# EAGLE design PLA_Controller_ring_Gen2_Rev2 (EAGLE 7.7.0)
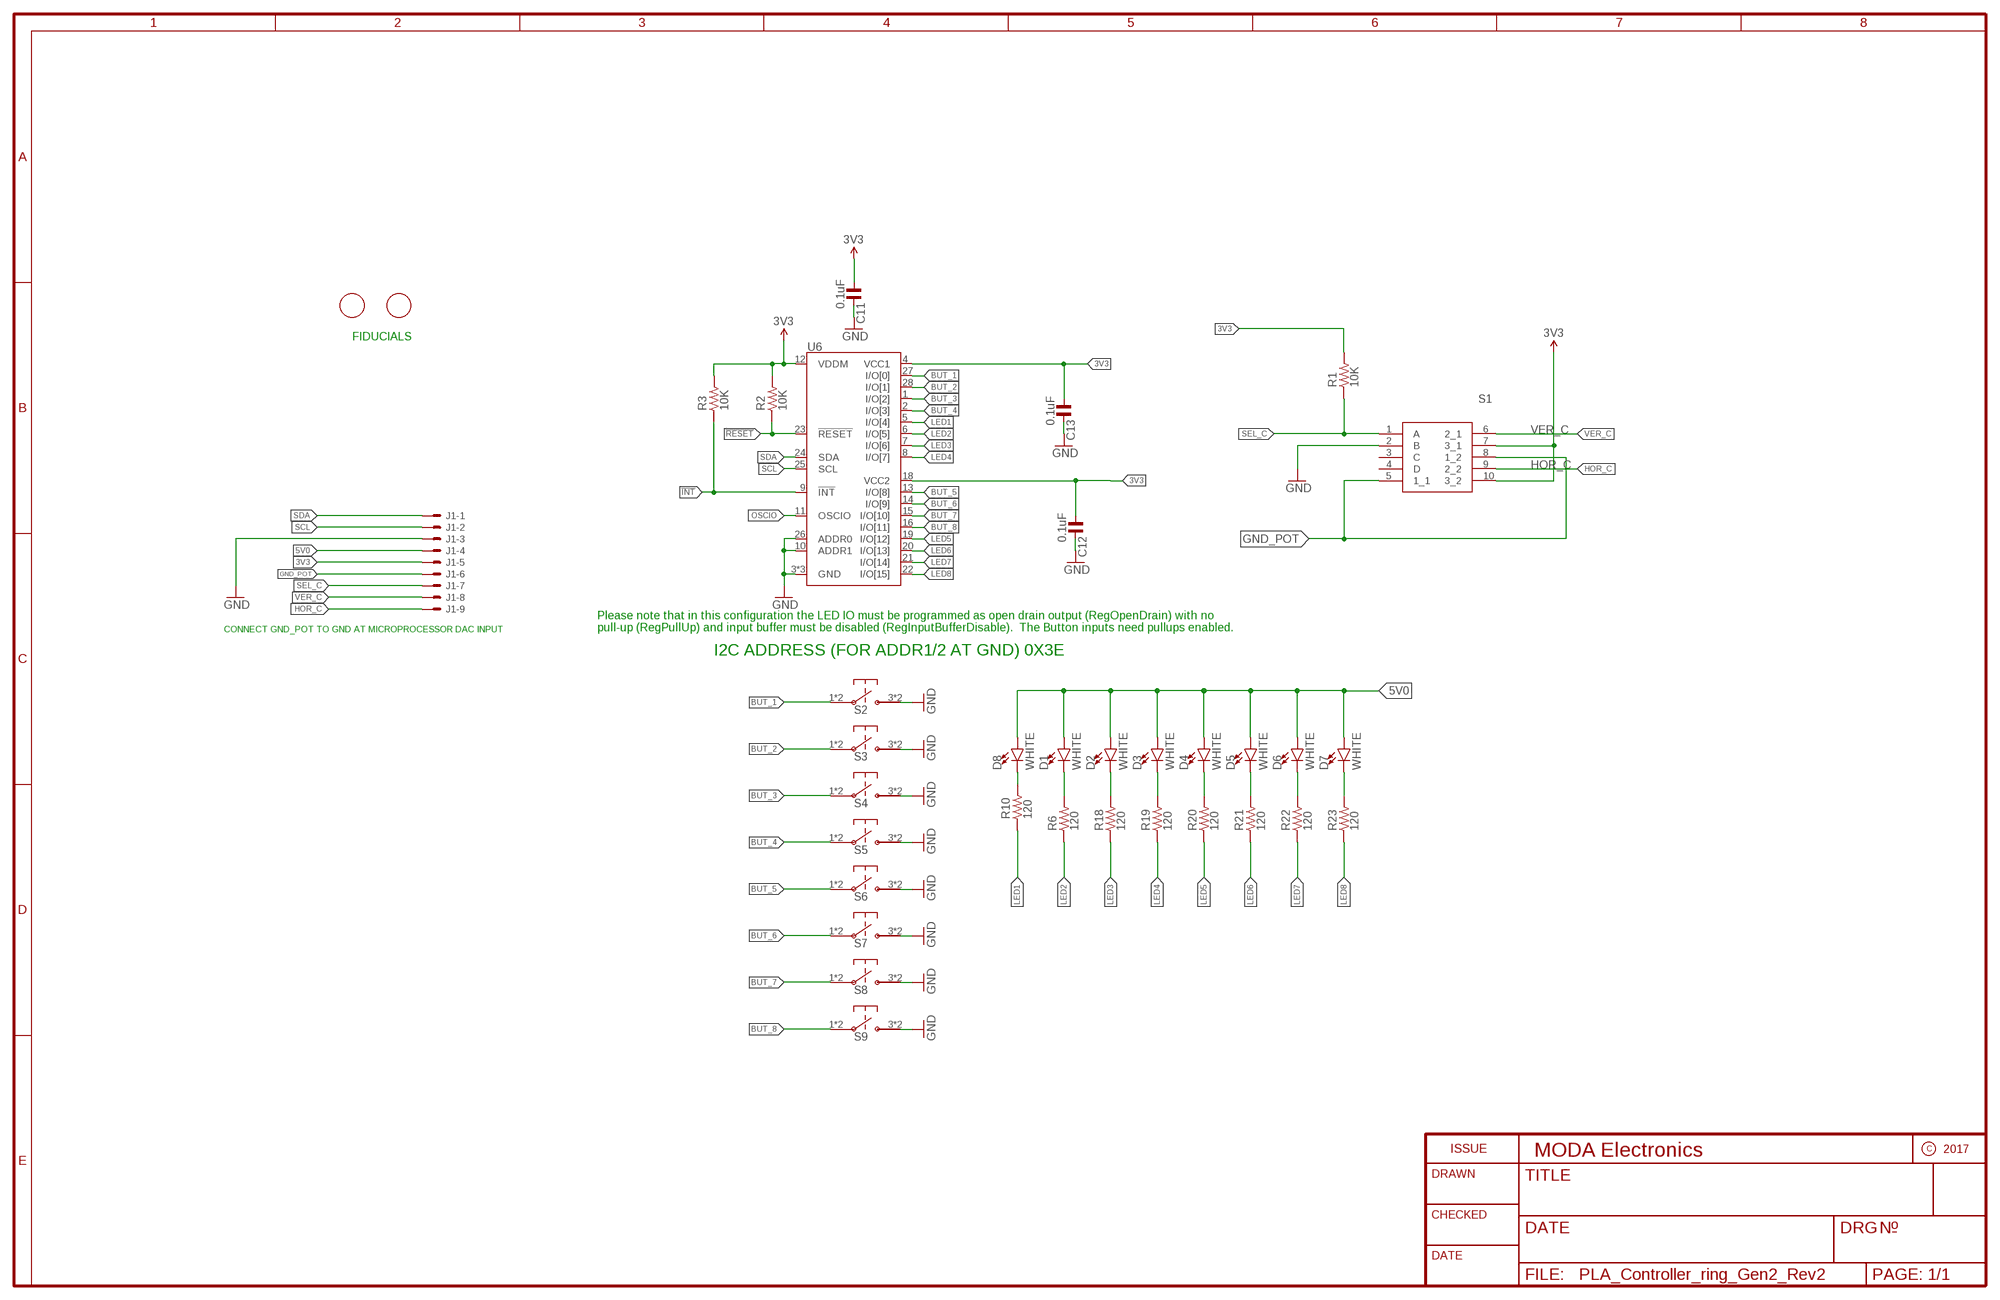
[diagram p0: schematic, sheet 1]

## Parts
C11  0.1uF  C_0603  [C0603]
C12  0.1uF  C_0603  [C0603]
C13  0.1uF  C_0603  [C0603]
D1  WHITE  LED-WHITE0603  [LED-0603]
D2  WHITE  LED-WHITE0603  [LED-0603]
D3  WHITE  LED-WHITE0603  [LED-0603]
D4  WHITE  LED-WHITE0603  [LED-0603]
D5  WHITE  LED-WHITE0603  [LED-0603]
D6  WHITE  LED-WHITE0603  [LED-0603]
D7  WHITE  LED-WHITE0603  [LED-0603]
D8  WHITE  LED-WHITE0603  [LED-0603]
J1  BM09B-SRSS-TB  [BM09B-SRSS-TB]
R1  10K  R_0603  [R0603]
R2  10K  R_0603  [R0603]
R3  10K  R_0603  [R0603]
R6  120  R_0603  [R0603]
R10  120  R_0603  [R0603]
R18  120  R_0603  [R0603]
R19  120  R_0603  [R0603]
R20  120  R_0603  [R0603]
R21  120  R_0603  [R0603]
R22  120  R_0603  [R0603]
R23  120  R_0603  [R0603]
S1  RKJXV1224005  [RKJXV1224005]
S2  TL3315NF100Q  [TL3315NF100Q]
S3  TL3315NF100Q  [TL3315NF100Q]
S4  TL3315NF100Q  [TL3315NF100Q]
S5  TL3315NF100Q  [TL3315NF100Q]
S6  TL3315NF100Q  [TL3315NF100Q]
S7  TL3315NF100Q  [TL3315NF100Q]
S8  TL3315NF100Q  [TL3315NF100Q]
S9  TL3315NF100Q  [TL3315NF100Q]
U6  SX1509  [QFN-28]
U$8  FIDUCIAL  [FIDUCIAL_1MM]
U$9  FIDUCIAL  [FIDUCIAL_1MM]

## Nets
3V3: C11.1 C12.1 C13.1 J1.5 R1.2 R2.2 R3.2 S1.7(3_1) S1.10(3_2) U6.4(VCC1) U6.12(VDDM) U6.18(VCC2)
5V0: D1.A D2.A D3.A D4.A D5.A D6.A D7.A D8.A J1.4
!INT: R3.1 U6.9(!INT)
!RESET: R2.1 U6.23(!RESET)
BUT_1: S2.1 S2.2 U6.27(I/O[0])
BUT_2: S3.1 S3.2 U6.28(I/O[1])
BUT_3: S4.1 S4.2 U6.1(I/O[2])
BUT_4: S5.1 S5.2 U6.2(I/O[3])
BUT_5: S6.1 S6.2 U6.13(I/O[8])
BUT_6: S7.1 S7.2 U6.14(I/O[9])
BUT_7: S8.1 S8.2 U6.15(I/O[10])
BUT_8: S9.1 S9.2 U6.16(I/O[11])
GND [vcc]: C11.2 C12.2 C13.2 J1.3 S1.2(B) S2.3 S2.4 S3.3 S3.4 S4.3 S4.4 S5.3 S5.4 S6.3 S6.4 S7.3 S7.4 S8.3 S8.4 S9.3 S9.4 U6.3(GND) U6.10(ADDR1) U6.17(GND) U6.26(ADDR0) U6.29(GND)
GND_POT [vcc]: J1.6 S1.5(1_1) S1.8(1_2)
HOR_C: J1.9 S1.9(2_2)
LED1: R10.1 U6.5(I/O[4])
LED2: R6.1 U6.6(I/O[5])
LED3: R18.1 U6.7(I/O[6])
LED4: R19.1 U6.8(I/O[7])
LED5: R20.1 U6.19(I/O[12])
LED6: R21.1 U6.20(I/O[13])
LED7: R22.1 U6.21(I/O[14])
LED8: R23.1 U6.22(I/O[15])
N$7: D1.C R6.2
N$10: D8.C R10.2
N$15: D2.C R18.2
N$16: D3.C R19.2
N$17: D4.C R20.2
N$18: D5.C R21.2
N$19: D6.C R22.2
N$20: D7.C R23.2
OSCIO: U6.11(OSCIO)
SCL: J1.2 U6.25(SCL)
SDA: J1.1 U6.24(SDA)
SEL_C: J1.7 R1.1 S1.1(A)
VER_C: J1.8 S1.6(2_1)
Unconnected: S1.3(C) S1.4(D)

## Notes on the sheet
- FIDUCIALS
- CONNECT GND_POT TO GND AT MICROPROCESSOR DAC INPUT
- Please note that in this configuration the LED IO must be programmed as open drain output (RegOpenDrain) with no
  pull-up (RegPullUp) and input buffer must be disabled (RegInputBufferDisable).  The Button inputs need pullups enabled.
- I2C ADDRESS (FOR ADDR1/2 AT GND) 0X3E

## Library data of the parts
C11-C13 = rc-master-smd:C_: NON-POLARIZED CAP; PARTNO: CAP-00810
D1-D8 = SparkFun-LED:LED-WHITE: White SMD LED Used in manufacturing several products at SparkFun. Packages: 0603 - Bright White SMD 0603 package[Product Link] <http://www.kingbrightusa.com/product.asp?catalog_name=LED&product_id=APT1608QWF/D> 1206 - Bright White SMD1206 package [Product Link] <http://www.kingbrightusa.com/product.asp?catalog_name=LED&product_id=APT3216QWF/D> SparkFun Products: Blackberry Trackballer Breakout <https://www.sparkfun.com/products/13169> Digital SandBox <https://www.sparkfun.com/products/12651>; PARTNO: QBLP601-IW
J1 = con-jst:?M09B-SRSS-TB: Disconnectable Crimp style connector, 1.0mm pitch 9 contacts; PARTNO: BM09B-SRSS-TB
R1-R3 = rc-master-smd:R_: RESISTOR; PARTNO: ERJ-2GEJ103X
R6 R10 R18-R23 = rc-master-smd:R_: RESISTOR; PARTNO: ERJ-PA3J121V
S1 = RKJXV1224005:RKJXV1224005: Multi-Directional Switches Stick Controller Source: Datasheet <http://www.alps.com/prod/info/E/HTML/MultiControl/Potentiometer/RKJXK/RKJXV1224005.html>; DESCRIPTION: Multi-Directional Switches Stick Controller; HEIGHT: mm; MANUFACTURER_NAME: ALPS; MANUFACTURER_PART_NUMBER: RKJXV1224005; MOUSER_PART_NUMBER: 688-RKJXV1224005; MOUSER_PRICE-STOCK: https://www.mouser.com/Search/Refine.aspx?Keyword=688-RKJXV1224005; PARTNO: RKJXV1224005; RS_PART_NUMBER: 1239578; RS_PRICE-STOCK: http://uk.rs-online.com/web/p/products/1239578
S2-S9 = TL3315NF100Q:TL3315NF100Q: SWITCH TACTILE SPST-NO 0.05A 15V; AVAILABILITY: Good; DESCRIPTION: TL3315 Series SPST 1 N Round Button J-Bend SMT Low Profile Tactile Switch; MF: E-Switch; MP: TL3315NF100Q; PACKAGE: None; PARTNO: TL3315NF100Q; PRICE: 0.13 USD
U6 = SparkFun-DigitalIC:SX1509: Semtech SX1509 The SX1509 is a complete ultra low voltage 1.2V to 3.6V General Purpose parallel Input/Output (GPIO) expanders ideal for low power handheld battery powered equipment. This version comes in a 16-channel configuration and allows easy serial expansion of I/O through a standard 400kHz I2C interface. GPIO devices can provide additional control and monitoring when the microcontroller or chipset has insufficient I/O ports, or in systems where serial communication and control from a remote location is advantageous.; PARTNO: SX1509BIULTRT; PROD_ID: IC-11311; VALUE: SX1509
U$8 U$9 = adafruit:FIDUCIAL: For use by pick and place machines to calibrate the vision/machine, 1mm By microbuilder.eu; DNP: T; PARTNO: *

## Net classes
0 default: width 0.203 mm
3 diff90: width 0.104 mm, drill 0.203 mm, clearance 0.127 mm

## Board
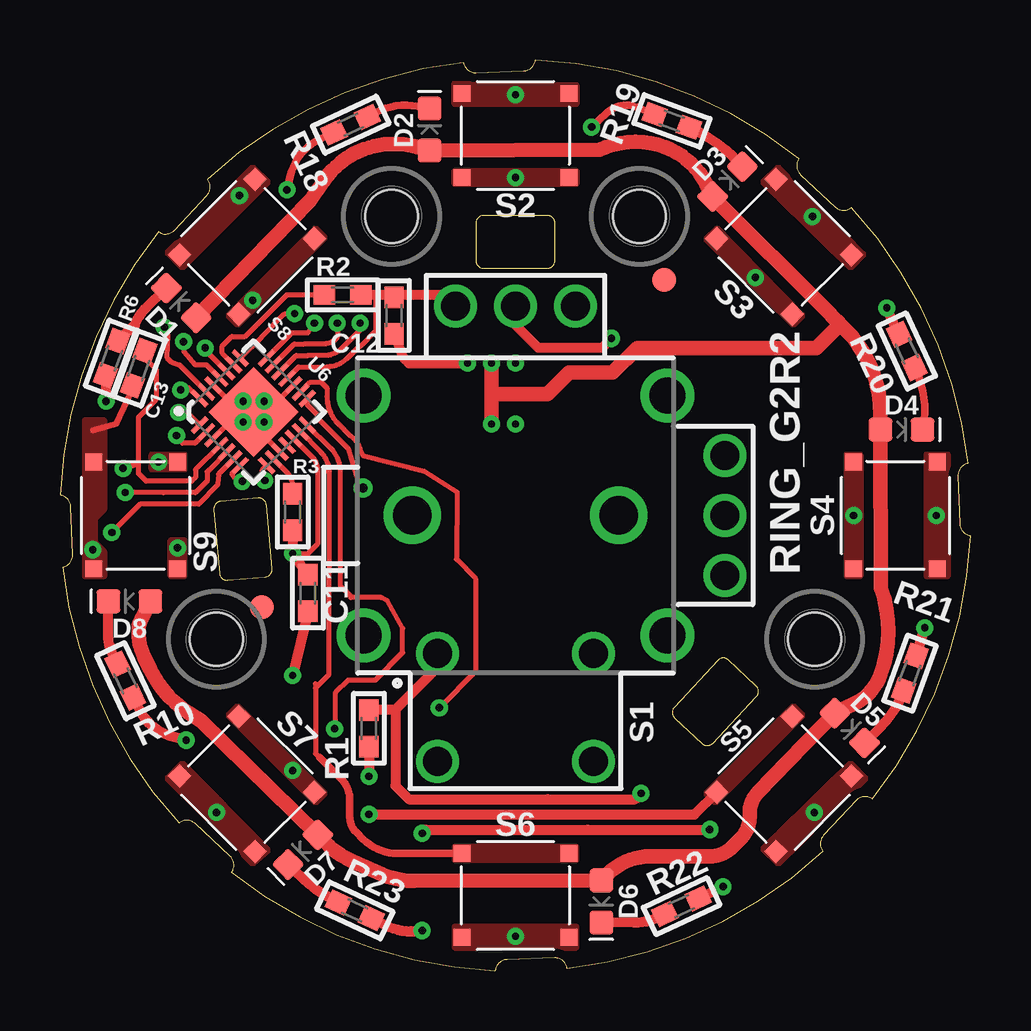
[diagram p1: board, top side]
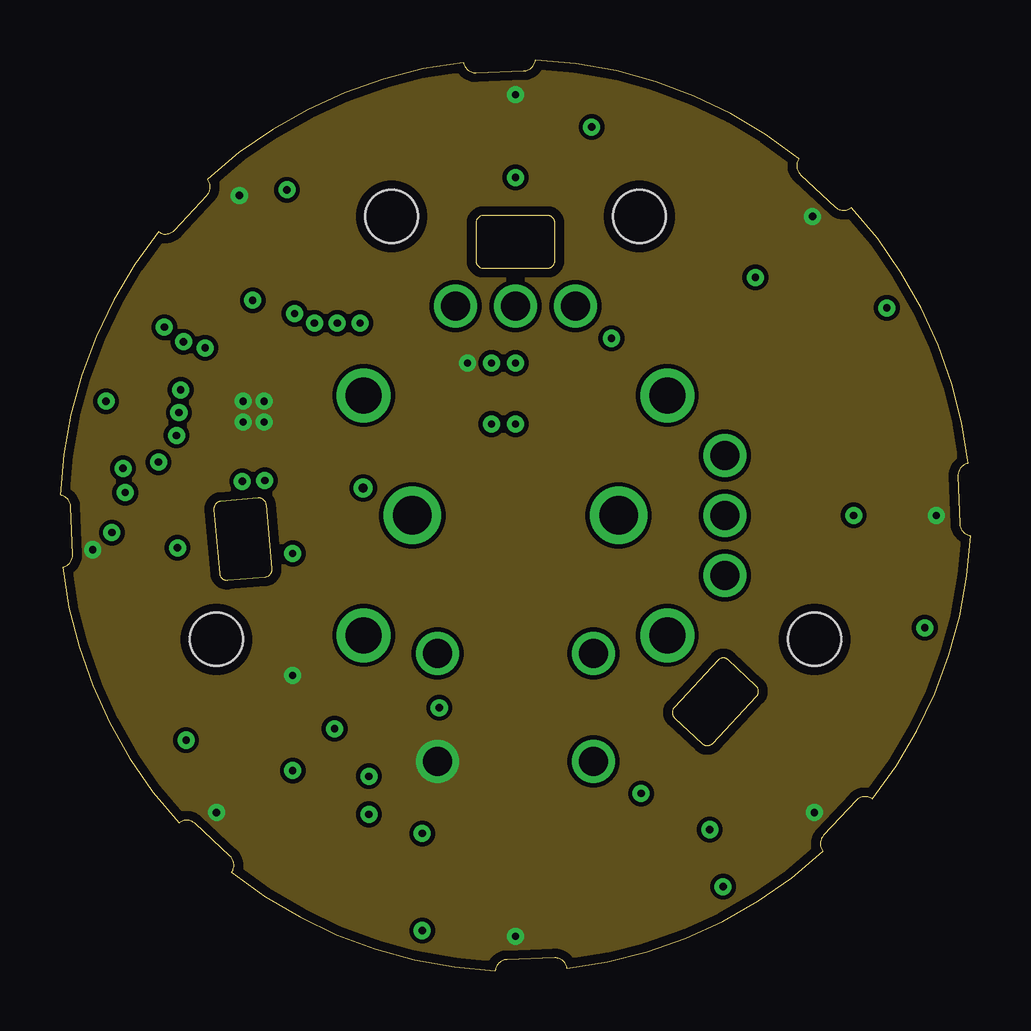
[diagram p2: board, inner layer GND]
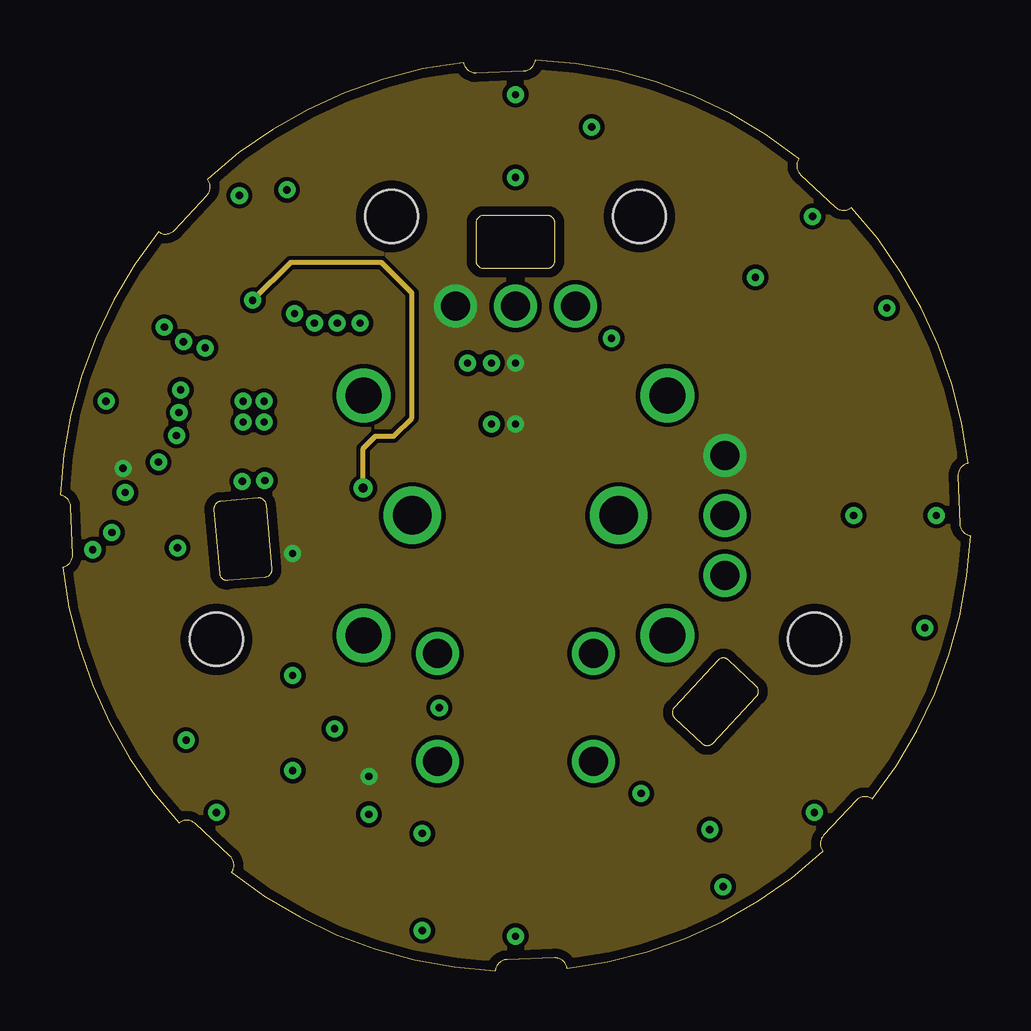
[diagram p3: board, inner layer Route15]
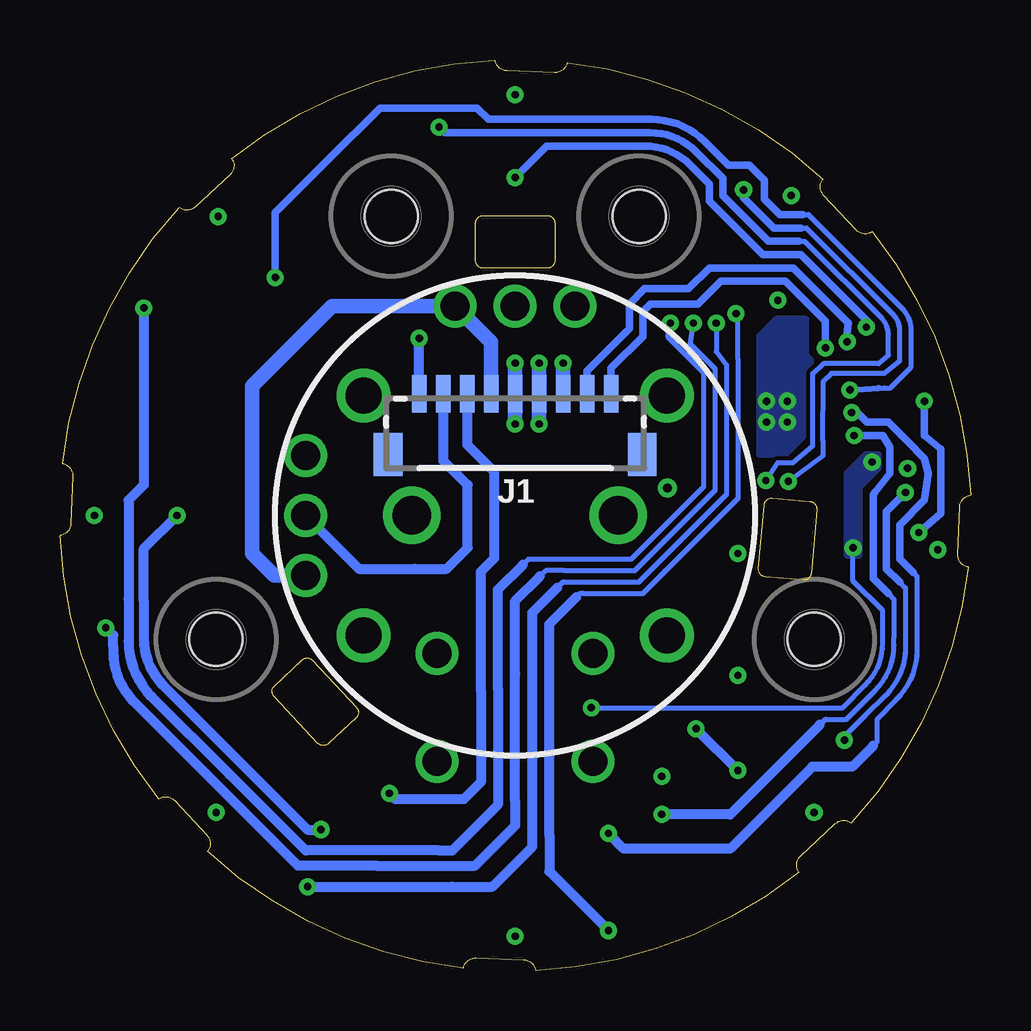
[diagram p4: board, bottom side, seen from below]

Size 37.96 x 37.96 mm. Coordinates in mm from the lower left corner, seen from the top.
Outline: 21.14,0.1 arc82 20.62,0.53 18.63,0.46 arc82 18.14,0 arc-36 7.16,4.11 arc82 7.09,4.77 5.64,6.13 arc82 4.97,6.15 arc-36 0.1,16.82 arc82 0.53,17.34 0.46,19.33 arc82 0,19.82 arc-36 4.11,30.8 arc82 4.77,30.87 6.13,32.33 arc82 6.15,33 arc-36 16.82,37.86 arc82 17.34,37.44 19.33,37.51 arc82 19.82,37.96 arc-36 30.8,33.86 arc82 30.87,33.19 32.33,31.83 arc82 33,31.81 arc-36 37.86,21.14 arc82 37.44,20.62 37.5,18.63 arc82 37.96,18.14 arc-36 33.86,7.16 arc82 33.19,7.09 31.83,5.64 arc82 31.81,4.97 arc-36 21.14,0.1
Outline: 25.62,10.53 26.77,9.47 arc90 27.22,9.48 29.04,11.43 arc90 29.02,11.88 27.87,12.95 arc90 27.43,12.93 25.61,10.98 arc90 25.62,10.53
Outline: 6.42,19.22 6.65,16.56 arc90 6.99,16.28 8.55,16.41 arc90 8.84,16.76 8.61,19.41 arc90 8.26,19.7 6.7,19.56 arc90 6.42,19.22
Outline: 17.33,31.16 17.33,29.6 arc90 17.65,29.28 20.32,29.28 arc90 20.63,29.6 20.63,31.16 arc90 20.32,31.48 17.65,31.48 arc90 17.33,31.16
Copper layers (1+2*15+16): Top 0.035mm / dielectric 0.45mm / GND 0.035mm / dielectric 0.55mm / Route15 0.035mm / dielectric 0.45mm / Bottom 0.035mm
Design rules "SSC-EAGLE-4Lyr_v1.0.0.3 *": minimum track width 7mil, minimum drill 12mil, track to track 7mil, track to pad 7mil, pad to pad 7mil, via to via 8mil, smd to smd 0mil, copper to edge 15mil, drill to drill 16mil, minimum pad ring 8mil, minimum via ring 8mil, stop-mask expansion 3mil, vias tented up to drill 14mil, thermal gap 10mil

### Footprints (pad centres in the part's own frame; a part is rotated, then mirrored left to right if it is on the bottom)
C0603 = smd 0.9 x 0.8: 1 -0.762,0; 2 0.762,0
LED-0603 = smd 1 x 1: A -0.877,0; C 0.877,0
BM09B-SRSS-TB = smd 0.6 x 1.55: 1 -4,-1.625; 2 -3,-1.625; 3 -2,-1.625; 4 -1,-1.625; 5 0,-1.625; 6 1,-1.625; 7 2,-1.625; 8 3,-1.625; 9 4,-1.625 | smd 1.2 x 1.8: FIT@1 5.3,0.9; FIT@2 -5.3,0.9
R0603 = smd 0.9 x 0.8: 1 -0.762,0; 2 0.762,0
RKJXV1224005 = drill 1.2 pad 1.8: 1 -3.25,-5.75; 2 -3.25,-10.25; 3 3.25,-5.75; 4 3.25,-10.25; 5 8.73,-2.5; 6 8.73,0; 7 8.73,2.5; 8 2.5,8.73; 9 0,8.73; 10 -2.5,8.73 | drill 1.5 pad 2.25: 11 -6.325,5; 12 6.325,5; 15 -6.325,-5; 16 6.325,-5 | drill 1.6 pad 2.4: 13 -4.3,0; 14 4.3,0
TL3315NF100Q = smd 0.7 x 0.7: 1 -2.225,1.75; 2 2.225,1.75; 3 -2.225,-1.75; 4 2.225,-1.75
QFN-28 = smd 0.85 x 0.2: 1 -1.975,1.2; 2 -1.975,0.8; 3 -1.975,0.4; 4 -1.975,0; 5 -1.975,-0.4; 6 -1.975,-0.8; 7 -1.975,-1.2; 15 1.975,-1.2; 16 1.975,-0.8; 17 1.975,-0.4; 18 1.975,0; 19 1.975,0.4; 20 1.975,0.8; 21 1.975,1.2 | smd 0.2 x 0.85: 8 -1.2,-1.975; 9 -0.8,-1.975; 10 -0.4,-1.975; 11 0,-1.975; 12 0.4,-1.975; 13 0.8,-1.975; 14 1.2,-1.975; 22 1.2,1.975; 23 0.8,1.975; 24 0.4,1.975; 25 0,1.975; 26 -0.4,1.975; 27 -0.8,1.975; 28 -1.2,1.975 | smd 2.65 x 2.65: 29 0,0
086 = hole 2.21: 0,0
FIDUCIAL_1MM = smd 1 x 1: 1 0,0

### Placement (x,y rotation side)
C11  10.34,15.74 270 top
C12  13.92,27.31 270 top
C13  3.28,25.12 250 top
D1  5.06,27.84 135 top
D2  15.41,35.07 90 top
D3  27.83,32.9 45 top
D4  35.08,22.56 0 top
D5  32.92,10.12 315 top
D6  22.57,2.89 270 top
D7  10.13,5.04 225 top
D8  2.9,15.39 180 top
J1  18.99,22.42 180 bottom
R1  12.88,10.1 270 top
R2  11.78,28.17 0 top
R3  9.7,19.12 270 top
R6  2.15,25.53 70 top
R10  2.73,12.08 115 top
R18  12.12,35.26 25 top
R19  25.51,35.42 340 top
R20  35.3,25.83 295 top
R21  35.43,12.4 250 top
R22  25.91,2.69 205 top
R23  12.29,2.51 155 top
S1  18.99,18.98 0 top
S2  18.99,34.81 180 top
S3  30.19,30.17 135 top
S4  34.83,18.98 90 top
S5  30.19,7.78 45 top
S6  18.99,3.14 0 top
S7  7.79,7.78 315 top
S8  7.79,30.17 225 top
S9  3.15,18.98 270 top
U6  8.07,23.29 45 top
U$2  [086]  6.52,13.81 0 top
U$3  [FAB_FRAME_ANSI-A]  -105.81,-109.71 0 top  (outside the outline)
U$4  [FAB_DOCFIELD_GENERIC]  48.7,-108.92 0 top  (outside the outline)
U$5  [086]  31.46,13.81 0 top
U$6  [086]  24.15,31.45 0 top
U$7  [086]  13.82,31.45 0 top
U$8  8.42,15.14 0 top
U$9  25.19,28.81 0 top

### Tracks (layer width: path | path; a pad name or v marks a point on that pad's centre or on a via)
3V3  (via drill 0.3)
  Top 0.203: C12.1 14.04,28.16 14.05,28.17 14.23,28.17 | 13.18,28.17 13.18,26.68 12.54,26.04 12.48,26.04 11.94,25.5 arc-45 11.13,25.17 9.94,25.17 U6.18 | C13.1 3.49,25.58 4,25.07 4,23.8 3.27,23.07 3.27,21.19 3.27,20.72 3.59,20.41 5.49,20.41 5.65,20.56 5.65,20.88 U6.4 | U6.12 10.51,21.42 arc-45 10.73,20.87 10.73,17.79 10.34,17.39 v9.7,17.39
  Top 0.254: v2.63,20.94 3.27,21.19
  Top 0.406: S1.10 16.03,28.17 14.23,28.17 13.18,28.17 R2.2 | C11.1 v9.7,17.39 R3.2 | R1.2 v12.88,8.1
  Bottom 0.61: v18.99,25.33 J1.5 v18.99,22.79
  pour Route15 (rank 2, no thermals): -1.73,-1.74 39.71,-1.74 39.71,39.69 -1.73,39.69
5V0  (via drill 0.3)
  Top 0.61: D8.A 3.42,14.73 arc28 3.27,14.13 arc26 3.51,13.08 3.76,12.56 arc31 5.35,10.75 5.89,10.4 D7.A 11,5.4 arc23 12.23,4.54 13.43,4.02 arc24 14.77,3.74 D6.A 22.83,4.02 arc-45 24.63,4.77 27.08,4.77 arc45 28.04,5.17 28.37,5.5 arc45 28.75,6.42 28.75,6.57 arc-44 29.1,7.43 D5.A 33.14,11.14 arc44 34.2,12.32 arc39 34.23,15.96 D4.A 34.2,23.18 arc45 32.73,26.75 32.2,27.27 | D1.A 10.42,32.07 11.01,32.94 arc-25 12.11,33.98 12.24,34.06 12.67,34.24 arc-23 13.76,34.45 14.07,34.45 arc-17 14.99,34.32 D2.A 22.48,34.22 arc-46 25.23,34.33 25.23,34.33 arc-42 26.93,32.82 D3.A 32.09,27.39 32.2,27.27 | v17.99,25.33 J1.4 | v17.99,22.79 J1.4 | J1.4 20.33,24.04 21.21,24.93 23.04,24.93 24.07,25.96 25.34,25.96 30.34,25.96 31.53,25.96 32.48,26.91 32.48,26.99 32.2,27.27
  Bottom 0.61: v17.99,25.33 J1.4 v17.99,22.79
!INT
  Top 0.203: U6.9 9.46,20.77 arc-45 9.7,20.19 R3.1
!RESET
  Top 0.203: U6.23 6.76,25.73 6.76,26.04 7.16,26.44 7.72,26.44 8.19,26.91 9.45,28.17 R2.1
BUT_1  (via drill 0.3)
  Top 0.203: U6.27 4.98,25.25 4.64,25.37 4.45,25.56 4.49,26.52 4.41,26.67 4.38,26.8 4.38,26.72 v4.35,26.83
  Bottom 0.305: v4.35,26.83 4.15,26.91 7.08,29.85 8.67,29.85 10.89,32.07 10.89,32.79 11.71,33.6 arc-45 13.57,34.38 14.62,34.38 17.68,34.38 v18.99,33.06
  pour Top (no thermals): 16.45,33.34 21.53,33.34 21.53,32.79 16.45,32.79
BUT_2  (via drill 0.3)
  Top 0.203: U6.28 5.37,24.29 4.86,24.29 5.14,24.32 v5.03,24.21
  Bottom 0.203: 3.83,24.29 3.59,24.29 3.35,24.29 2.48,25.17 2.48,26.12 2.48,26.69 arc-45 2.86,27.61 6.76,31.52 7,31.52
  Bottom 0.254: v5.03,24.21 3.83,24.29
  Bottom 0.305: 7,31.52 7.48,31.52 7.96,31.52 8.59,32.15 8.59,32.95 9.23,33.58 10.1,33.58 11.08,34.56 arc-45 13.31,35.49 13.99,35.49 19.39,35.49 20.1,35.49 20.58,35.96 22.56,35.96 24.62,35.96 26.77,33.82 28.99,31.6 v28.99,28.9
  pour Top (no thermals): 26.93,30.49 27.4,30.96 30.97,27.31 30.58,26.91
BUT_3  (via drill 0.3)
  Top 0.203: U6.1 5.31,23.26 v4.96,23.26
  Top 0.406: v15.1,5.72 15.26,5.88 22,5.88 v27.08,5.88
  Bottom 0.203: 2.4,16.6 2.24,16.44 2.24,15.33 2.24,13.38 arc45 3.11,11.28 3.91,10.48 3.91,9.53 4.07,9.37
  Bottom 0.305: v4.96,23.26 4.73,23.26 4.34,22.87 3.43,22.87 2.64,22.07 1.92,21.36 1.77,20.73 1.92,19.61 2.95,18.58 2.95,17.15 2.4,16.6 | 5.18,8.5 4.94,8.5
  Bottom 0.406: 4.07,9.37 4.94,8.5 6.61,8.5 10.02,5.09 13.43,5.09 14.46,5.09 v15.1,5.72 | v33.09,18.98 34.47,17.6 34.47,15.4 34.47,13.83 arc-45 33.67,11.91 27.64,5.88 v27.08,5.88
  pour Top (no thermals): 32.8,21.52 33.36,21.52 33.36,16.44 32.8,16.44
BUT_4  (via drill 0.3)
  Top 0.203: U6.2 5.63,21.99 5.1,21.99 v4.86,22.31
  Top 0.406: v12.88,6.51 26.45,6.51 S5.1
  Bottom 0.203: 3.43,15.72 3.19,15.48 3.19,13.9 3.19,13.58 arc45 3.98,11.68 5.18,10.48 6.05,10.48 6.29,10.25
  Bottom 0.305: v4.86,22.31 3.67,22.31 3.37,21.83 3.37,20.72 3.99,19.93 4.07,19.85 4.07,18.58 4.07,16.36 3.43,15.72
  Bottom 0.406: 6.29,10.25 10.02,6.51 v12.88,6.51
  pour Top (no thermals): 27.32,6.99 30.97,10.64 30.58,11.04 26.93,7.39
BUT_5
  Top 0.203: U6.13 10.85,21.64 arc-45 11.21,20.78 11.21,16.6 11.21,12.34 10.65,11.79 | 10.65,11.79 10.65,11.96 10.65,11.79 | 10.65,11.79 10.65,9.05 10.81,8.9
  Top 0.305: 10.81,8.9 11.72,7.99 arc-45 12.08,7.12 12.08,6.41 arc45 12.34,5.78 12.64,5.48 arc45 14.07,4.89 14.5,4.89 S6.1
  pour Top (no thermals): 16.45,4.61 21.53,4.61 21.53,5.17 16.45,5.17
BUT_6  (via drill 0.3)
  Top 0.203: U6.14 11.27,21.79 arc-45 11.69,20.79 11.69,16.04 12.13,15.6 12.13,15.55 13.4,15.55 13.65,15.42 14.29,14.28 14.29,13.26 13.15,12.12 12,12.12 11.5,11.61 11.5,10.09
  Top 0.254: v11.45,10.09 11.5,10.09
  Bottom 0.406: v11.45,10.09 v9.7,8.34
  pour Top (no thermals): 7,10.64 7.4,11.04 11.05,7.39 10.65,6.99
BUT_7  (via drill 0.3, 0.38)
  Top 0.203: U6.15 10.31,23.59 10.73,23.17 10.73,23.04 12,21.77 12.51,20.12 v12.64,20.12
  Route15 0.203: v12.64,20.12 12.64,21.77 13.15,22.28 13.91,22.28 14.67,23.04 14.67,28.25 13.4,29.52 9.61,29.52 v8.03,27.95
  pour Top (no thermals): 10.65,30.96 11.05,30.57 7.4,26.91 7,27.31
BUT_8  (via drill 0.3)
  Top 0.203: U6.16 10.44,24.53 10.65,24.53 10.89,24.53 11.05,24.37 11.13,24.29 11.13,23.94 arc45 11.61,22.78 12.08,22.32 arc-45 12.51,21.72 12.64,21.47 15.18,20.82 16.56,19.94 16.53,17.15 17.32,16.36 17.32,12.47 v15.81,10.96
  Bottom 0.203: v4.9,17.63 4.9,16.24 3.67,15.01 3.67,13.64 arc45 4.39,11.91 5.34,10.96 v15.81,10.96
  other vias: 4.11,21.2
  pour Top (no thermals): 5.18,20.88 3.83,20.88 3.83,21.52 5.18,21.52
  pour Top (no thermals): 5.18,16.44 4.62,16.44 4.62,17.94 5.18,17.94
  pour Bottom (no thermals): 5.18,17.31 4.62,17.31 4.62,20.17 3.83,20.96 3.83,21.52 4.38,21.52 5.18,20.72
GND  (via drill 0.3)
  Top 0.203: 8.08,23.29 v8.51,22.87 8.51,22.28 U6.10 | 8.08,23.29 U6.29 | U6.3 7.07,22.87 v7.64,22.87 | U6.26 7.06,23.74 v7.64,23.74 8.03,23.34 8.08,23.29 | U6.17 9.08,23.74 v8.51,23.74
  Top 0.254: C13.2 3.11,24.44 2.35,22.79 1.37,22.52
  Top 0.406: C12.2 14.31,25.56 14.54,25.33 v16.99,25.33 | C11.2 v9.7,12.31
  Bottom 0.61: J1.3 v16.99,25.33
  other vias: 31.45,6.59 18.99,1.43 6.53,6.59 1.37,17.55 7.48,32.31 18.99,36.52 31.37,31.44 36.53,18.98
  pour GND (rank 2, no thermals): -1.33,39.3 39.31,39.3 39.31,-1.34 -1.33,-1.34
  pour Top (no thermals): 29.31,32.87 29.94,33.5 33.51,29.85 32.96,29.3
  pour Top (no thermals): 16.45,36.12 16.45,36.99 21.53,36.92 21.53,36.12
  pour Top (no thermals): 4.46,29.93 8.03,33.5 8.67,32.87 5.1,29.3
  pour Top (no thermals): 1.05,16.44 1.05,22.95 1.84,22.95 1.84,19.21 1.45,18.82 1.45,17.87 1.84,17.47 1.84,16.44
  pour Top (no thermals): 8.03,4.45 4.46,8.02 5.1,8.66 8.67,5.01
  pour Top (no thermals): 16.45,0.96 21.53,0.96 21.53,1.83 16.45,1.83
  pour Top (no thermals): 29.31,5.09 32.96,8.66 33.59,8.02 29.94,4.45
  pour Top (no thermals): 36.13,21.52 37.01,21.52 37.01,16.44 36.13,16.44
  pour Bottom (rank 2, no thermals): 8.83,21.52 7.72,21.52 6.45,22.79 6.45,25.25 6.84,25.64 6.84,27.15 8.11,27.15 8.83,26.44
GND_POT
  Bottom 0.61: J1.6 19.99,26.21 S1.8 26.61,27.71 29.94,24.37 29.94,18.98 29.94,17.39 29.03,16.48 S1.5
HOR_C  (via drill 0.3)
  Top 0.406: S1.9 18.99,26.91 19.27,26.64 | 19.27,26.64 19.31,26.6 | v22.99,26.36 22.59,25.96 20.66,25.96 19.94,25.96 19.27,26.64
  Bottom 0.406: J1.9 v22.99,26.36
LED1  (via drill 0.3)
  Top 0.203: U6.5 6.21,20.87 6.13,20.79 6.13,20.41 5.65,19.93 4.3,19.93 3.03,19.93 v2.72,19.93
  Top 0.406: R10.1 3.3,10.89 arc49 4.71,9.76 v5.26,9.61
  Bottom 0.203: 2.95,16.2 2.72,15.96 2.72,13.48 arc45 3.54,11.48 4.38,10.64 5.26,9.77 v5.26,9.61
  Bottom 0.305: v2.72,19.93 3.43,19.21 3.51,19.14 3.51,17.39 3.51,16.75 2.95,16.2
LED2  (via drill 0.3)
  Top 0.203: U6.6 6.61,20.7 6.58,20.27 5.79,19.45 3.35,19.45 v2.16,18.26
  Top 0.406: R6.1 v1.92,23.74
  Bottom 0.305: v1.92,23.74 1.92,22.31 1.24,21.75 1.24,19.06 v2.16,18.26
LED3  (via drill 0.3)
  Top 0.203: U6.7 7.16,20.69 7.29,20.53 v7.6,20.4
  Top 0.305: R18.1 10.88,34.69 arc52 9.6,33.12 v9.46,32.55
  Bottom 0.203: v7.6,20.4 6.16,21.46 6.16,22.08 6.13,24.58 5.81,24.9 3.59,24.9 2.95,25.41 2.95,26.69 arc-45 3.23,27.34 6.84,30.96 7.08,30.96
  Bottom 0.305: v9.46,32.55 9.46,32.23 8.19,30.96 7.08,30.96
LED4  (via drill 0.3)
  Top 0.203: v8.54,20.43 8.43,20.48 8.43,20.87 U6.8
  Top 0.305: R19.1 24.06,35.99 arc66 22.79,35.76 v22.16,35.17
  Bottom 0.203: v8.54,20.43 8.05,21.17 7.41,21.17 6.58,21.87 6.58,24.9 6.13,25.3 3.83,25.3 3.43,25.64 3.43,26.52 arc-45 3.71,27.19 6.92,30.41 7.16,30.41
  Bottom 0.305: 7.16,30.41 8.43,30.41 10.34,32.31 10.34,33.03 11.45,34.14 arc-45 13.36,34.93 21.93,34.93 v22.16,35.17
LED5  (via drill 0.3)
  Top 0.203: U6.19 9.85,25.64 10.34,25.64 11.01,25.64 arc45 11.76,25.95 12.64,26.83 v12.51,26.99
  Top 0.406: R20.1 v34.47,27.63
  Bottom 0.203: v12.51,26.99 12.64,26.44 11.13,24.93 11.13,20.17 13.43,17.87 | 18.67,16.91 18.43,17.15 16.85,17.15 14.15,17.15 13.43,17.87 | 13.43,17.87 13.04,18.26
  Bottom 0.406: 18.67,16.91 19.7,15.88 19.7,11.75 19.7,9.13 19.7,6.91 21.61,5.01 22.16,5.01 27.72,5.01 30.89,8.18 34.15,11.44 arc45 35.1,13.73 35.1,15.48 35.1,19.61 34.47,20.25 v34.47,27.63
LED6  (via drill 0.3)
  Top 0.203: U6.20 9.76,26.12 10.18,26.12 10.95,26.12 arc45 11.53,26.36 arc45 11.56,26.74 v11.56,26.99
  Top 0.406: R21.1 v36.05,14.29
  Bottom 0.203: v11.56,26.99 11.69,26.12 10.65,25.09 10.65,20.01 13.19,17.47 13.99,16.67 16.92,16.67 17.72,16.67 17.96,16.44
  Bottom 0.406: 17.96,16.44 18.99,15.4 18.99,12.39 18.99,7.07 18.99,6.04 20.66,4.37 24.78,4.37 28.04,4.37 31.21,7.55 34.88,11.22 arc45 35.74,13.28 35.74,13.49 35.74,13.98 v36.05,14.29
LED7  (via drill 0.3)
  Top 0.203: U6.21 9.67,26.6 10.34,26.6 v10.61,26.99
  Top 0.406: R22.1 v27.64,3.5
  Bottom 0.203: v10.61,26.99 10.61,25.8 10.18,25.25 10.18,19.85 12.96,17.07 13.83,16.2 16.92,16.2 17,16.2 17.24,15.96
  Bottom 0.406: v27.64,3.5 21.61,3.5 19.94,3.5 18.27,5.17 18.27,12.31 18.27,14.93 17.24,15.96
LED8  (via drill 0.3)
  Top 0.203: U6.22 8.42,26.44 9.37,27.39 v9.78,27.39
  Top 0.406: R23.1 13.55,1.9 arc32 14.82,1.65 v15.1,1.67
  Bottom 0.203: v9.78,27.39 9.7,27.31 9.7,25.49 9.7,19.69 12.84,16.56 | 16.45,15.56 16.29,15.72 16.13,15.72 13.67,15.72 12.84,16.56 | 12.84,16.56 12.72,16.67
  Bottom 0.406: 16.45,15.56 17.56,14.45 17.56,12.79 17.56,5.64 17.56,4.13 v15.1,1.67
N$7
  Top 0.406: R6.2 3.11,26.91 arc-24 3.58,27.62 D1.C
N$10
  Top 0.406: R10.2 2.2,13.19 arc-27 2.01,14.01 D8.C
N$15
  Top 0.305: R18.2 13.16,35.77 arc-38 14.91,36.03 D2.C
N$16
  Top 0.406: R19.2 arc-25 28.39,33.58 D3.C
N$17
  Top 0.305: R20.2 35.68,25.03 arc-36 35.98,22.67 D4.C
N$18
  Top 0.406: R21.2 35.11,11.52 arc-23 34.17,10.12 D5.C
N$19
  Top 0.406: R22.2 24.96,2.24 arc-27 23.91,2 D6.C
N$20
  Top 0.406: R23.2 11.29,3 arc-15 10.13,3.84 D7.C
SCL  (via drill 0.3)
  Top 0.203: U6.25 6.11,25.25 5.65,25.25 5.17,25.8 v5.15,26.22
  Bottom 0.305: J1.2 15.99,24.99 14.23,26.76 14.23,27.79 13.59,28.42 11.77,28.42 10.89,29.3 8.99,29.3 7.4,29.3 5.1,26.99 5.22,26.01 5.17,25.99 v5.15,26.22
SDA  (via drill 0.3)
  Top 0.203: U6.24 6.05,25.88 v6.05,25.96
  Bottom 0.305: J1.1 14.99,25.12 13.67,26.44 13.67,27.47 13.35,27.79 11.37,27.79 10.42,28.74 8.75,28.74 7.72,28.74 6.05,27.07 v6.05,25.96
SEL_C  (via drill 0.3)
  Top 0.406: 13.99,10.88 13.04,10.88 12.89,10.88 R1.1 | 13.99,10.88 15.74,12.63 S1.1 | 13.99,10.88 13.99,7.71 14.54,7.15 20.34,7.15 23.99,7.15 v24.23,7.39
  Bottom 0.406: J1.7 20.99,21.93 19.86,20.8 19.86,17.19 20.42,16.64 20.42,11.67 20.42,9.13 20.42,7.86 21.13,7.15 23.99,7.15 v24.23,7.39
VER_C
  Bottom 0.406: J1.8 21.99,21.26 20.97,20.25 20.97,17.63 21.85,16.75 23.2,16.75 25.5,16.75 S1.6

### Text on the board
tNames: RING_G2R2
Document: CONNECT PCB TO PANEL FRAME AT ARROWS | NOTES: | FILES | 1. PRINTED CIRCUIT BOARD MADE FROM NEMA GRADE FR-4 EPOXY LAMINATE | WITH 1 OUNCE COPPER PLATING AND .063 THICKNESS. | 2. ALL DIMENSIONS ARE GIVEN IN INCHES. | 3. CIRCUIT PATHS ARE FOR REFERENCE ONLY. | 4. HOLE SIZES SHOWN ARE FINISHED DIAMETERS AFTER PLATING. | 5. BOARD PLATED USING REFLOW OR SIMILAR METHOD. | 6. APPLY GREEN SOLDER MASK ON PLATED SURFACES USING WET FILM SR100 | OR SR1010 EPOXY. EQUIVALENT WET OR DRY FILM MAY BE USED. | 7. SILKSCREEN TOP and BOTTOM SIDE USING WHITE INK. | 8. THE FOLLOWING INFORMATION APPLIES TO THIS BOARD: | A) 4 COPPER LAYERS | B) 0.063 BOARD THICKNESS | C) REQUIRES TOP AND BOTTOM SILKSCREEN | DRL =DRILL TOOL SIZE INFORMATION (INCHES) / DRD =JOB DRILL DATA (NC DRILL LOCATION INFO) / OLN =OUTLINE / L1 =TOP LAYER (POS LAYER) / SLK=SILKSCREEN TOP / BSK=SILKSCREEN BOT / SMT=SOLDER MASK TOP / SMB=SOLDER MASK BOT / L2 =INNER LAYER 1 / L3 =INNER LAYER 2 / L4 =BOT LAYER / TPS=TOP STENCIL / BPS=BOTTOM STENCIL / MNT=PLACE FILE TOP / MNB=PLACE FILE BOTTOM / BOM= BILL OF MATERIALS / SCHEMATIC / FABDRAWING | Board stackup (mm) / / Layer 1 0.035 foil thickness / Bonding ply 0.45 Dielectric Constant 4.5 (+/- 0.10) / Layer 2 0.035 foil thickness / Laminate Core 0.55 Dielectric Constant 4.5 (+/- 0.10) / Layer 3 0.035 foil thickness / Bonding ply 0.45 Dielectric Constant 4.5 (+/- 0.10) / Layer 4 0.035 foil thickness / / Total Thickness 1.59